# Altium schematic sheet config-bank4.SchDoc: Config FPGA - Bank 4
size Letter; CheckedBy: E. Chiu; CompanyName: Brinton Engineering, LLC; DrawnBy: J. Brinton; Engineer: J. Brinton; Address1: 3479 Edison Way; Address2: Menlo Park CA 94025; Address3: +1 (877) 778-8435; Address4: brintonengineering.com; Revision: 1; SheetNumber: 22; SheetTotal: 71
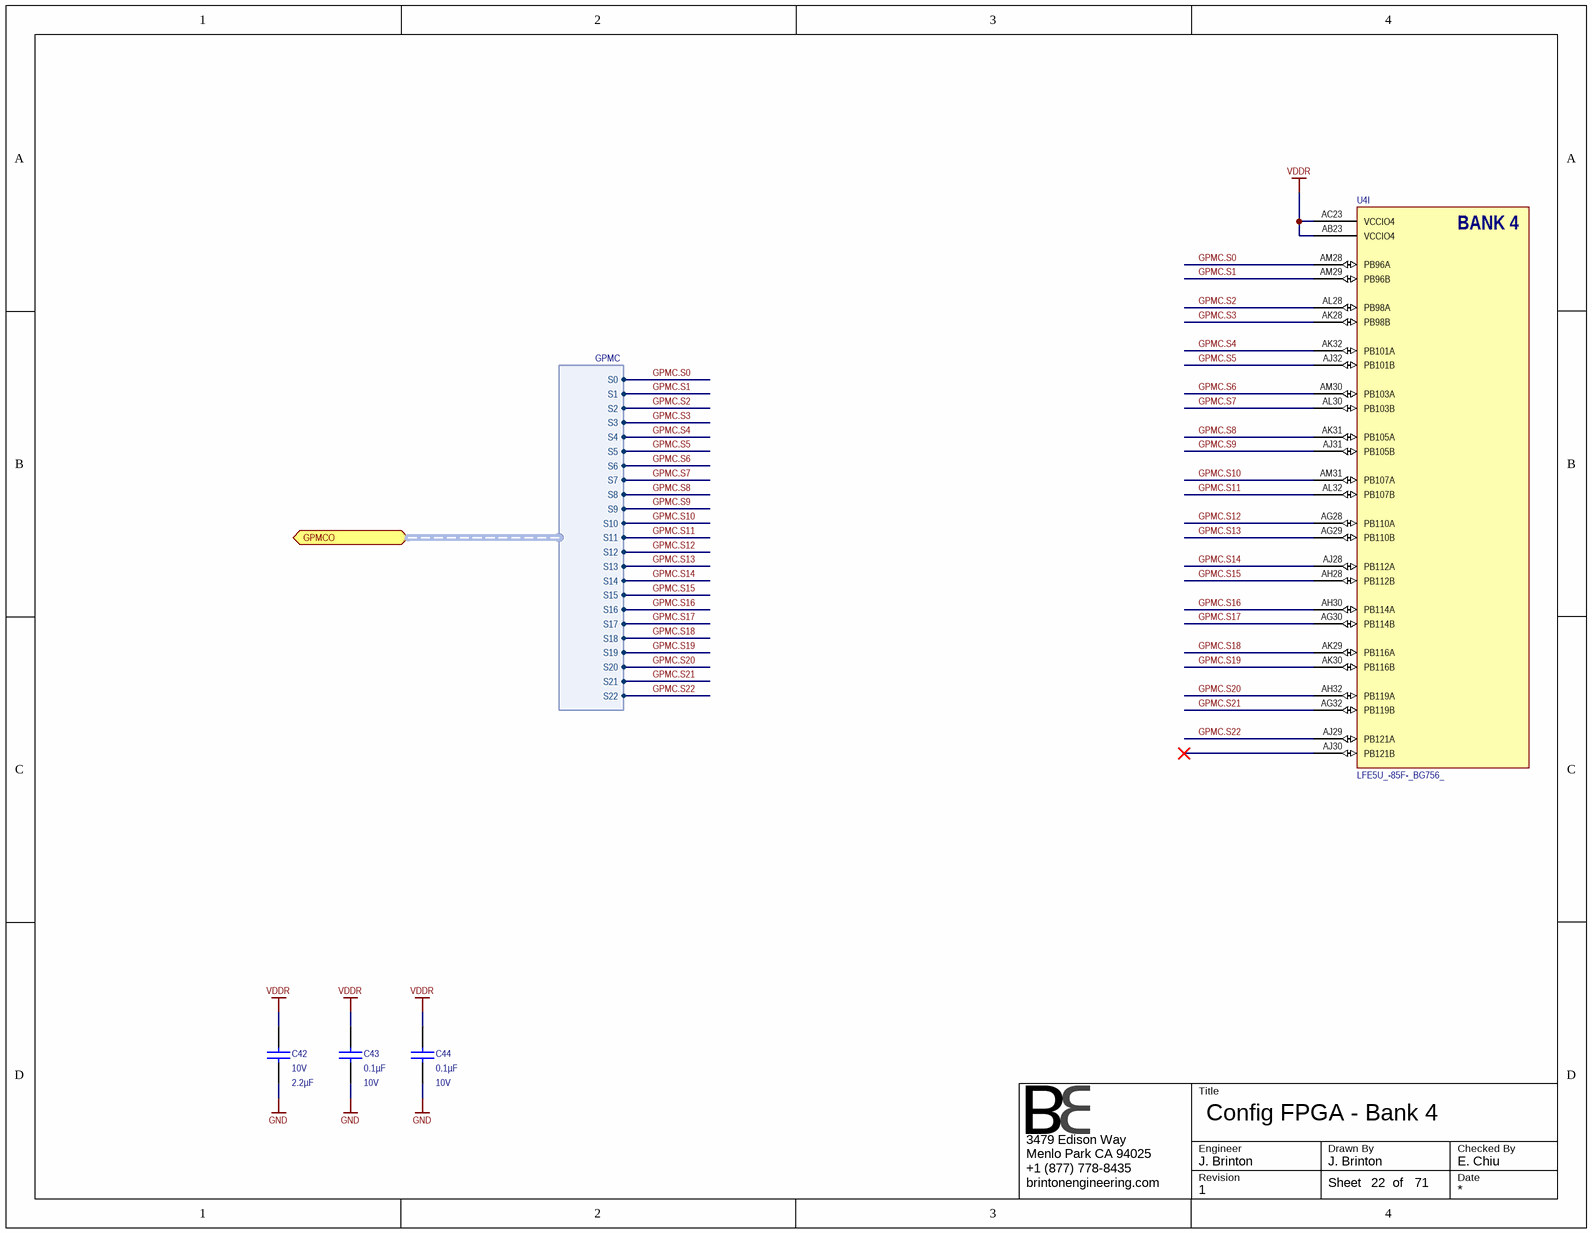
[diagram p0: config-bank4.SchDoc]

## Parts
C42  Voltage - Rated: 10V  Capacitance: 2.2µF  [CAPC1608X90N]  (hidden comment: GRM188R71A225KE15D)
C43  Capacitance: 0.1µF  Voltage - Rated: 10V  [CAPC1005X56N]  (hidden comment: GRM155R71A104KA01J)
C44  Capacitance: 0.1µF  Voltage - Rated: 10V  [CAPC1005X56N]  (hidden comment: GRM155R71A104KA01J)
U4  LFE5U_-85F-_BG756_  [caBGA756]  (part I of 19)

## Ports
GPMCO (harness GPMC)

## Harnesses
GPMC: S0, S1, S2, S3, S4, S5, S6, S7, S8, S9, S10, S11, S12, S13, S14, S15, S16, S17, S18, S19, S20, S21, S22

## Nets
GND: C42.1 C43.1 C44.1
VDDR: C42.2 C43.2 C44.2 U4.AB23(VCCIO4) U4.AC23(VCCIO4)
GPMC.S0: U4.AM28(PB96A) ; port GPMCO.S0
GPMC.S1: U4.AM29(PB96B) ; port GPMCO.S1
GPMC.S2: U4.AL28(PB98A) ; port GPMCO.S2
GPMC.S3: U4.AK28(PB98B) ; port GPMCO.S3
GPMC.S4: U4.AK32(PB101A) ; port GPMCO.S4
GPMC.S5: U4.AJ32(PB101B) ; port GPMCO.S5
GPMC.S6: U4.AM30(PB103A) ; port GPMCO.S6
GPMC.S7: U4.AL30(PB103B) ; port GPMCO.S7
GPMC.S8: U4.AK31(PB105A) ; port GPMCO.S8
GPMC.S9: U4.AJ31(PB105B) ; port GPMCO.S9
GPMC.S10: U4.AM31(PB107A) ; port GPMCO.S10
GPMC.S11: U4.AL32(PB107B) ; port GPMCO.S11
GPMC.S12: U4.AG28(PB110A) ; port GPMCO.S12
GPMC.S13: U4.AG29(PB110B) ; port GPMCO.S13
GPMC.S14: U4.AJ28(PB112A) ; port GPMCO.S14
GPMC.S15: U4.AH28(PB112B) ; port GPMCO.S15
GPMC.S16: U4.AH30(PB114A) ; port GPMCO.S16
GPMC.S17: U4.AG30(PB114B) ; port GPMCO.S17
GPMC.S18: U4.AK29(PB116A) ; port GPMCO.S18
GPMC.S19: U4.AK30(PB116B) ; port GPMCO.S19
GPMC.S20: U4.AH32(PB119A) ; port GPMCO.S20
GPMC.S21: U4.AG32(PB119B) ; port GPMCO.S21
GPMC.S22: U4.AJ29(PB121A) ; port GPMCO.S22

Not connected (* = marked no-connect by the designer): U4 AJ30(PB121B)*

## Notes on the sheet
- Title
- Engineer
- Revision
- Drawn By
- Checked By
- Date
- Sheet
- of
- (in symbol LFE5U_-85F-_BG756_, part I) BANK 4

## Library data of the parts
C42 = GRM188R71A225KE15D: CAP CER 2.2UF 10V 10% X7R 0603; Manufacturer: Murata Electronics North America; Manufacturer P/N: GRM188R71A225KE15D; Operating Temperature: -55°C ~ 125°C; Thickness (Max): 0.035" (0.90mm); Tolerance: ±10%; Package / Case: 0603 (1608 Metric); Temperature Coefficient: X7R; Supplier 1: Newark; Supplier 2: Digi-Key; RoHS: RoHS Compliant; Size / Dimension: 0.063" L x 0.031" W (1.60mm x 0.80mm); Mounting Type: Surface Mount, MLCC; ComponentLink1URL: http://www.murata.com/~/media/webrenewal/support/library/catalog/products/capacitor/mlcc/c02e.ashx; ComponentLink1Description: http://www.murata.com/~/media/webrenewal/support/library/catalog/products/capacitor/mlcc/c02e.ashx; Supplier Part Number 1: 72R4209; Supplier Part Number 2: 490-4520-1-ND
C43 C44 = GRM155R71A104KA01J: CAP CER 0.1UF 10V 10% X7R 0402; Manufacturer: Murata Electronics North America; Manufacturer P/N: GRM155R71A104KA01J; Operating Temperature: -55°C ~ 125°C; Thickness (Max): 0.022" (0.55mm); Size / Dimension: 0.039" L x 0.020" W (1.00mm x 0.50mm); RoHS: RoHS Compliant; Mounting Type: Surface Mount, MLCC; Supplier 1: Digi-Key; ComponentLink1URL: http://www.murata.com/~/media/webrenewal/support/library/catalog/products/capacitor/mlcc/c02e.ashx; ComponentLink1Description: http://www.murata.com/~/media/webrenewal/support/library/catalog/products/capacitor/mlcc/c02e.ashx; Supplier Part Number 1: 490-6322-1-ND; Temperature Coefficient: X7R; Package / Case: 0402 (1005 Metric); Tolerance: ±10%
U4 = LFE5U_-85F-_BG756_: ECP5 FPGA, 85k LUT, 756-caBGA; Manufacturer: Lattice Semiconductor; Manufacturer P/N: LFE5U_-85F-_BG756_